# Altium schematic sheet JD-Signal-SCH-V1.2.SchDoc
size A2; SheetNumber: 1; SheetTotal: 1; SPICEModelCacheNNRSJVYG: <root> / <DocumentId>NNRSJVYG</DocumentId> / <CacheFrame Number="0"> / <Model Name="npn" Kind="MDL"> / <Text>*Default NPN BJT / *NPN Trans Pinout: C,B,E / .MODEL NPN NPN()</Text> / </Model> / <Model Name="xtal" Kind="CKT"> / <Text>*Generic type:crystal pkg:HC33/51 / .SUBCKT XTAL 1 2 PARAMS: FREQ=1Meg RS=750 C=13pf Q=1000 / LX 1 3 {((Q*RS)/(6.2831852*FREQ))} IC=0.5M / CX 3 4 {(1/(Q*6.2831852*FREQ*RS))} / C0 1 2 {C} / RS 4 2 {RS} / .ENDS XTAL</Text> / </Model> / </CacheFrame> / </root>
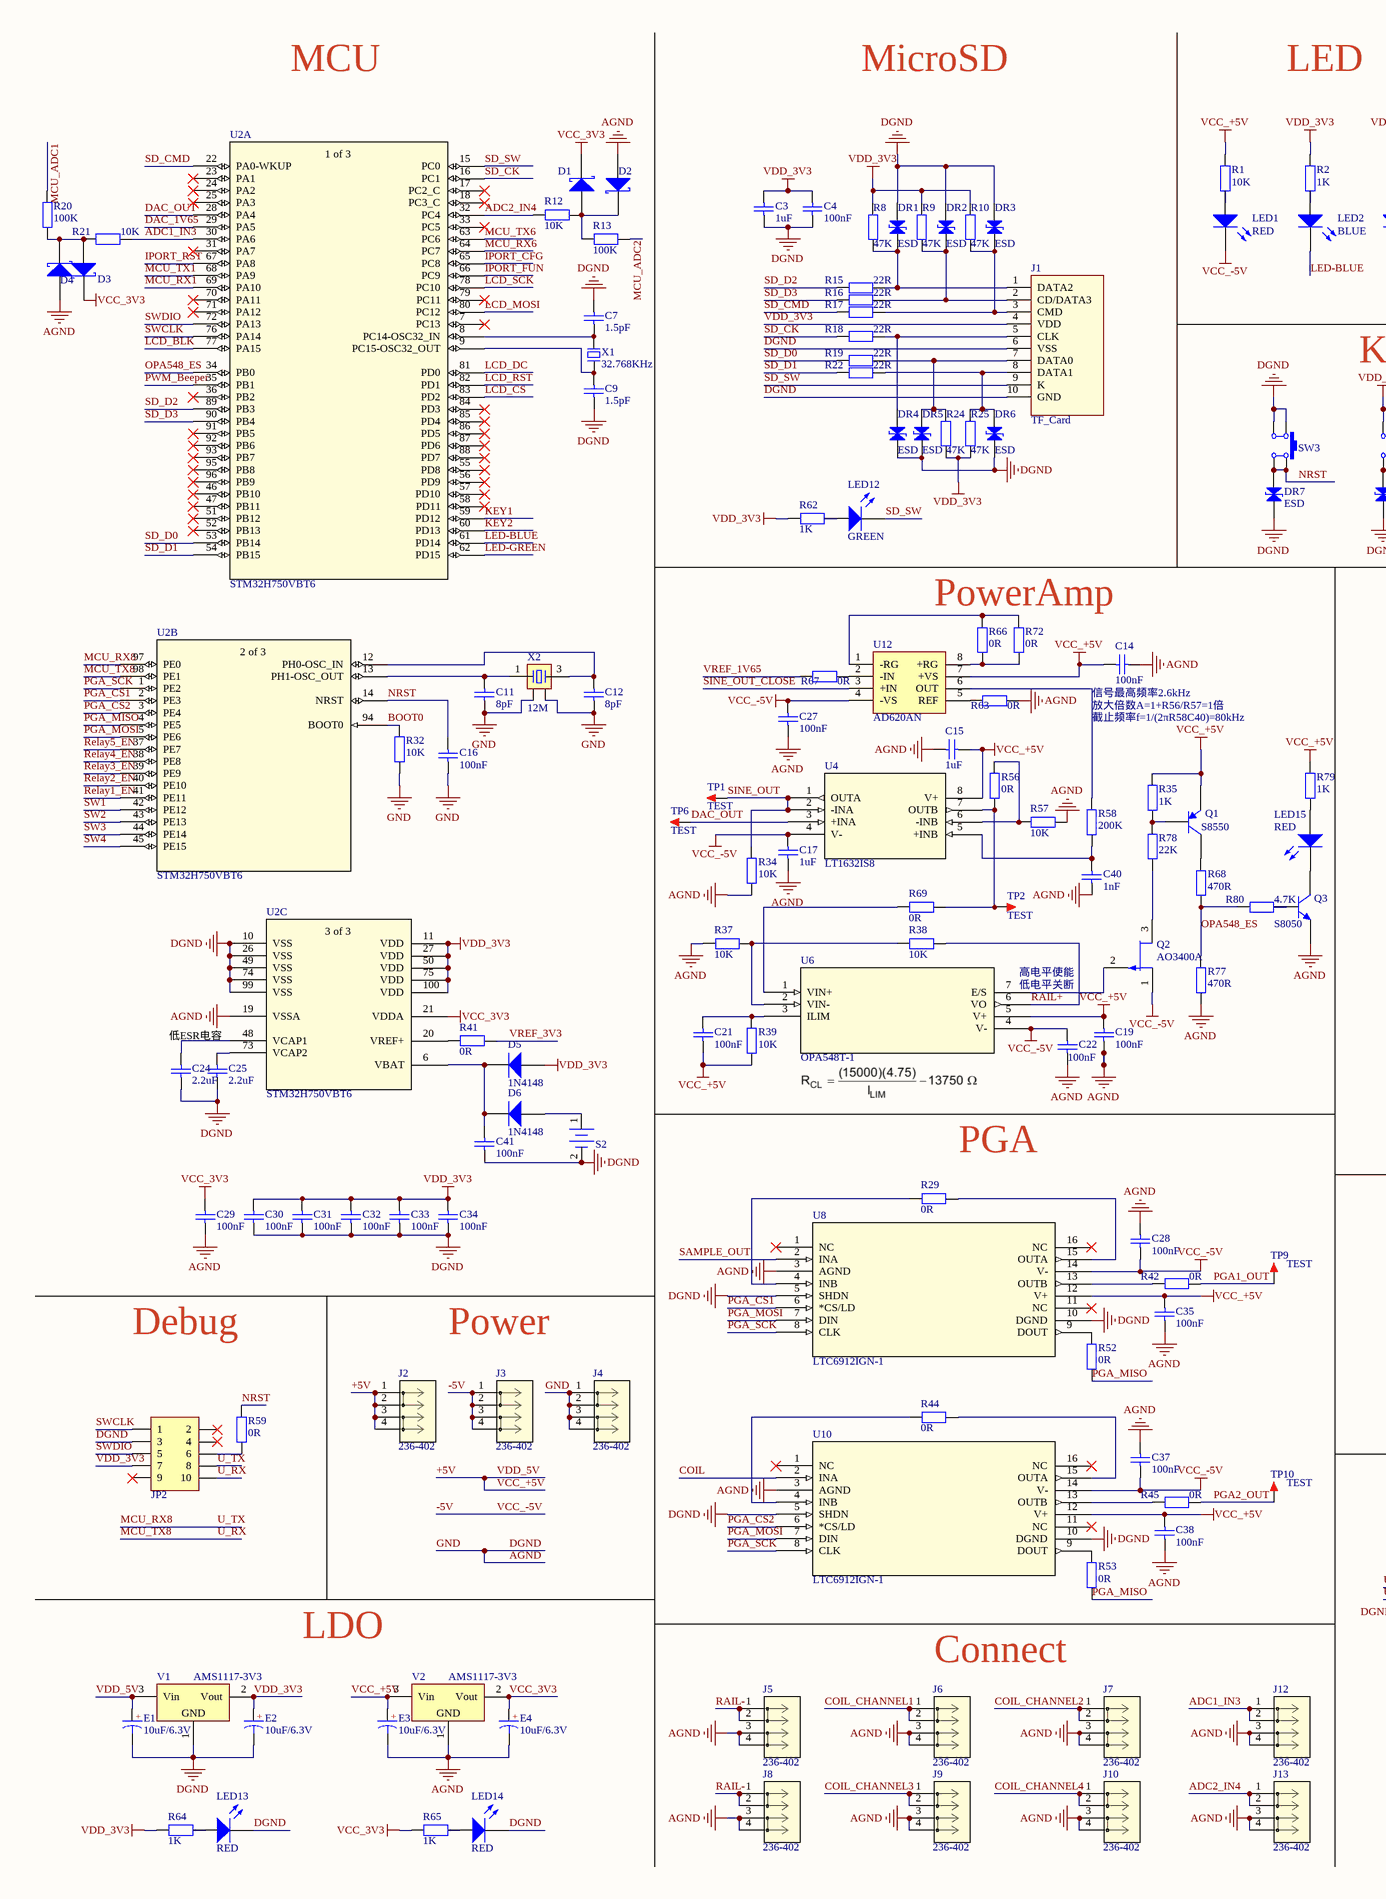
[diagram p0: JD-Signal-SCH-V1.2.SchDoc, left]
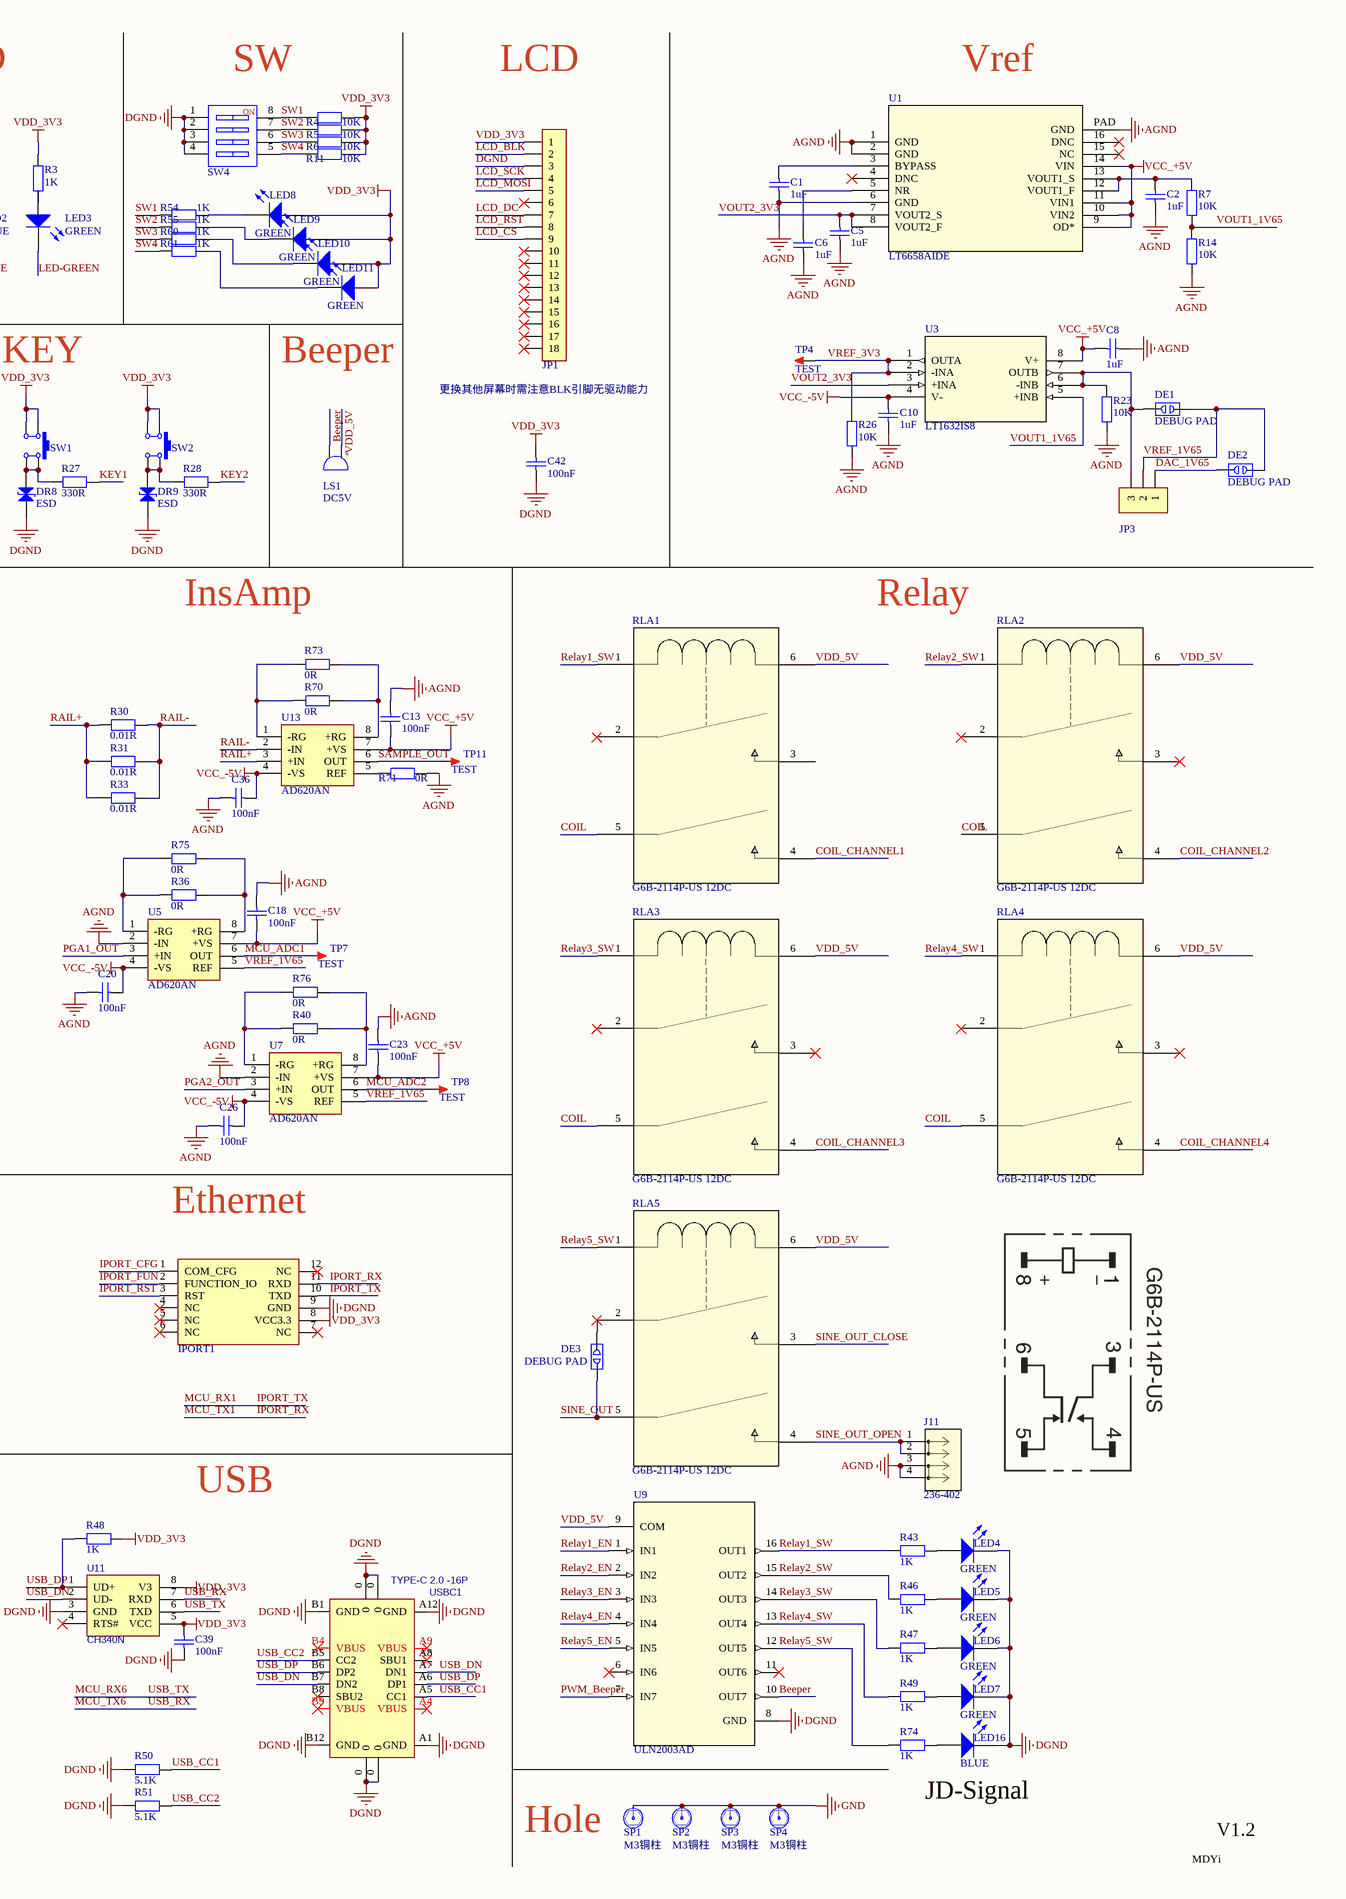
[diagram p1: JD-Signal-SCH-V1.2.SchDoc, right]

## Parts
C1  1uF  [C0603_M]
C2  1uF  [C0603_M]
C3  1uF  [C0603_M]
C4  100nF  [C0603_M]
C5  1uF  [C0603_M]
C6  1uF  [C0603_M]
C7  1.5pF  [C0603_M]
C8  1uF  [C0603_M]
C9  1.5pF  [C0603_M]
C10  1uF  [C0603_M]
C11  8pF  [C0603_M]
C12  8pF  [C0603_M]
C13  100nF  [C0603_M]
C14  100nF  [C0603_M]
C15  1uF  [C0603_M]
C16  100nF  [C0603_M]
C17  1uF  [C0603_M]
C18  100nF  [C0603_M]
C19  100nF  [C0603_M]
C20  100nF  [C0603_M]
C21  100nF  [C0603_M]
C22  100nF  [C0603_M]
C23  100nF  [C0603_M]
C24  2.2uF  [C0603_M]
C25  2.2uF  [C0603_M]
C26  100nF  [C0603_M]
C27  100nF  [C0603_M]
C28  100nF  [C0603_M]
C29  100nF  [C0603_M]
C30  100nF  [C0603_M]
C31  100nF  [C0603_M]
C32  100nF  [C0603_M]
C33  100nF  [C0603_M]
C34  100nF  [C0603_M]
C35  100nF  [C0603_M]
C36  100nF  [C0603_M]
C37  100nF  [C0603_M]
C38  100nF  [C0603_M]
C39  100nF  [C0603_M]
C40  1nF  [C0603_M]
C41  100nF  [C0603_M]
C42  100nF  [C0603_M]
D1  VS10BQ015HM3  [SMB]  (value not drawn)
D2  VS10BQ015HM3  [SMB]  (value not drawn)
D3  VS10BQ015HM3  [SMB]  (value not drawn)
D4  VS10BQ015HM3  [SMB]  (value not drawn)
D5  1N4148  [SOD-123]
D6  1N4148  [SOD-123]
DE1  DEBUG PAD  [DEBUG_B]
DE2  DEBUG PAD  [DEBUG_B]
DE3  DEBUG PAD  [DEBUG_B]
DR1  ESD  [0402]
DR2  ESD  [0402]
DR3  ESD  [0402]
DR4  ESD  [0402]
DR5  ESD  [0402]
DR6  ESD  [0402]
DR7  ESD  [0402]
DR8  ESD  [0402]
DR9  ESD  [0402]
E1  10uF/6.3V  [C_3216]
E2  10uF/6.3V  [C_3216]
E3  10uF/6.3V  [C_3216]
E4  10uF/6.3V  [C_3216]
IPORT1  IPORT-3  [IPORT]  (value not drawn)
J1  TF_Card  [Micro SD]
J2  236-402  [CONN_236-402_WAG]
J3  236-402  [CONN_236-402_WAG]
J4  236-402  [CONN_236-402_WAG]
J5  236-402  [CONN_236-402_WAG]
J6  236-402  [CONN_236-402_WAG]
J7  236-402  [CONN_236-402_WAG]
J8  236-402  [CONN_236-402_WAG]
J9  236-402  [CONN_236-402_WAG]
J10  236-402  [CONN_236-402_WAG]
J11  236-402  [CONN_236-402_WAG]
J12  236-402  [CONN_236-402_WAG]
J13  236-402  [CONN_236-402_WAG]
JP1  CON-18P  [FPC0.5-WT-18P]  (value not drawn)
JP2  Header 5X2  [HDR2.54-LI-2x5P]  (value not drawn)
JP3  HDR-1X3  [HDR2.54-LI-3P]  (value not drawn)
LED1  RED  [LED0603_R]
LED2  BLUE  [LED0603_R]
LED3  GREEN  [LED0603_R]
LED4  GREEN  [LED0603_R]
LED5  GREEN  [LED0603_R]
LED6  GREEN  [LED0603_R]
LED7  GREEN  [LED0603_R]
LED8  GREEN  [LED0603_R]
LED9  GREEN  [LED0603_R]
LED10  GREEN  [LED0603_R]
LED11  GREEN  [LED0603_R]
LED12  GREEN  [LED0603_R]
LED13  RED  [LED0603_R]
LED14  RED  [LED0603_R]
LED15  RED  [LED0603_R]
LED16  BLUE  [LED0603_R]
LS1  DC5V  [BEEP 5x9x5.5]
Q1  S8550  [SOT23]
Q2  AO3400A  [SOT23]
Q3  S8050  [SOT23]
R1  10K  [R0603_M]
R2  1K  [R0603_M]
R3  1K  [R0603_M]
R4  10K  [R0603_M]
R5  10K  [R0603_M]
R6  10K  [R0603_M]
R7  10K  [R0603_M]
R8  47K  [R0603_M]
R9  47K  [R0603_M]
R10  47K  [R0603_M]
R11  10K  [R0603_M]
R12  10K  [R0603_M]
R13  100K  [R0603_M]
R14  10K  [R0603_M]
R15  22R  [R0603_M]
R16  22R  [R0603_M]
R17  22R  [R0603_M]
R18  22R  [R0603_M]
R19  22R  [R0603_M]
R20  100K  [R0603_M]
R21  10K  [R0603_M]
R22  22R  [R0603_M]
R23  10K  [R0603_M]
R24  47K  [R0603_M]
R25  47K  [R0603_M]
R26  10K  [R0603_M]
R27  330R  [R0603_M]
R28  330R  [R0603_M]
R29  0R  [R0603_M]
R30  0.01R  [HS25]
R31  0.01R  [HS25]
R32  10K  [R0603_M]
R33  0.01R  [HS25]
R34  10K  [R0603_M]
R35  1K  [R0603_M]
R36  0R  [R0603_M]
R37  10K  [R0603_M]
R38  10K  [R0603_M]
R39  10K  [R1210_M]
R40  0R  [R0603_M]
R41  0R  [R0603_M]
R42  0R  [R0603_M]
R43  1K  [R0603_M]
R44  0R  [R0603_M]
R45  0R  [R0603_M]
R46  1K  [R0603_M]
R47  1K  [R0603_M]
R48  1K  [R0603_M]
R49  1K  [R0603_M]
R50  5.1K  [R0603_M]
R51  5.1K  [R0603_M]
R52  0R  [R0603_M]
R53  0R  [R0603_M]
R54  1K  [R0603_M]
R55  1K  [R0603_M]
R56  0R  [R0603_M]
R57  10K  [R0603_M]
R58  200K  [R0603_M]
R59  0R  [R0603_M]
R60  1K  [R0603_M]
R61  1K  [R0603_M]
R62  1K  [R0603_M]
R63  0R  [R0603_M]
R64  1K  [R0603_M]
R65  1K  [R0603_M]
R66  0R  [R0603_M]
R67  0R  [R0603_M]
R68  470R  [R0603_M]
R69  0R  [R0603_M]
R70  0R  [R0603_M]
R71  0R  [R0603_M]
R72  0R  [AXIAL0.5-1/2W]
R73  0R  [AXIAL0.5-1/2W]
R74  1K  [R0603_M]
R75  0R  [AXIAL0.5-1/2W]
R76  0R  [AXIAL0.5-1/2W]
R77  470R  [R0603_M]
R78  22K  [R0603_M]
R79  1K  [R0603_M]
R80  4.7K  [R0603_M]
RLA1  G6B-2114P-US 12DC  [RELAY_G6B-2114P_OMR]
RLA2  G6B-2114P-US 12DC  [RELAY_G6B-2114P_OMR]
RLA3  G6B-2114P-US 12DC  [RELAY_G6B-2114P_OMR]
RLA4  G6B-2114P-US 12DC  [RELAY_G6B-2114P_OMR]
RLA5  G6B-2114P-US 12DC  [RELAY_G6B-2114P_OMR]
S2  VBAT  [CR2032  BS-5]  (value not drawn)
SP1  M3铜柱  [M3x4+6_N]
SP2  M3铜柱  [M3x4+6_N]
SP3  M3铜柱  [M3x4+6_N]
SP4  M3铜柱  [M3x4+6_N]
SW1  4x4x1.5  [SW SMD-3*6*2.5]  (value not drawn)
SW2  4x4x1.5  [SW SMD-3*6*2.5]  (value not drawn)
SW3  4x4x1.5  [SW SMD-3*6*2.5]  (value not drawn)
SW4  DIP-SW-4P  [SW DIP-4P]  (value not drawn)
TP1  TEST  [TEST 1.6]
TP2  TEST  [TEST 1.6]
TP4  TEST  [TEST 1.6]
TP6  TEST  [TEST 1.6]
TP7  TEST  [TEST 1.6]
TP8  TEST  [TEST 1.6]
TP9  TEST  [TEST 1.6]
TP10  TEST  [TEST 1.6]
TP11  TEST  [TEST 1.6]
U1  LT6658AIDE  [MSOP16]
U2  STM32H750VBT6  [LQFP100-14*14]  (parts A,B,C of 3)
U3  LT1632IS8  [SO-8]
U4  LT1632IS8  [SO-8]
U5  AD620AN  [SOIC-8]
U6  OPA548T-1  [TO-220-7 - 90*45]
U7  AD620AN  [SOIC-8]
U8  LTC6912IGN-1  [SSOP-16]
U9  ULN2003AD  [SOP16]
U10  LTC6912IGN-1  [SSOP-16]
U11  CH340N  [SOIC-8]
U12  AD620AN  [SOIC-8]
U13  AD620AN  [SOIC-8]
USBC1  TYPE-C 2.0 -16P  [USB-C-SMD_16P]
V1  AMS1117-3V3  [SOT89_L]
V2  AMS1117-3V3  [SOT89_L]
X1  32.768KHz  [XTAL-3215-2P]
X2  12M  [XTAL-3225-4P]

## Nets
+5V: C8.1 C13.1 C14.2 C15.2 C18.1 C19.1 C21.1 C23.1 C35.2 C38.2 E1.1(A) E3.1(A) J2.1 J2.2 J2.3 J2.4 LS1.1 Q1.1(E) R1.2 R35.1 R39.1 R79.1 RLA1.6 RLA2.6 RLA3.6 RLA4.6 RLA5.6 U1.9(OD*) U1.10(VIN2) U1.11(VIN1) U1.14(VIN) U3.8(V+) U4.8(V+) U5.7(+VS) U6.5(V+) U7.7(+VS) U8.12(V+) U9.9(COM) U10.12(V+) U12.7(+VS) U13.7(+VS) V1.3(Vin) V2.3(Vin)  [also labelled VCC_+5V, VDD_5V]
-5V: C10.2 C17.2 C20.1 C22.2 C26.1 C27.1 C28.1 C36.1 C37.1 J3.1 J3.2 J3.3 J3.4 LED1.2(K) Q2.1(D) U3.4(V-) U4.4(V-) U5.4(-VS) U6.4(V-) U7.4(-VS) U8.14(V-) U10.14(V-) U12.4(-VS) U13.4(-VS)  [also labelled VCC_-5V]
AGND: C1.1 C2.1 C3.1 C4.1 C5.1 C6.1 C7.1 C8.2 C9.1 C10.1 C11.1 C12.1 C13.2 C14.1 C15.1 C16.1 C17.1 C18.2 C19.2 C20.2 C22.1 C23.2 C24.1 C25.1 C26.2 C27.2 C28.2 C29.1 C30.1 C31.1 C32.1 C33.1 C34.1 C35.1 C36.2 C37.2 C38.1 C39.1 C40.1 C41.1 C42.1 D2.1(A) D4.1(A) DR1.1(A) DR2.1(A) DR3.1(A) DR4.2(K) DR5.2(K) DR6.2(K) DR7.2(K) DR8.2(K) DR9.2(K) E1.2(K) E2.2(K) E3.2(K) E4.2(K) IPORT1.9(GND) J1.6(VSS) J1.10(GND) J4.1 J4.2 J4.3 J4.4 J5.3 J5.4 J6.3 J6.4 J7.3 J7.4 J8.3 J8.4 J9.3 J9.4 J10.3 J10.4 J11.3 J11.4 J12.3 J12.4 J13.3 J13.4 JP1.3 JP2.3 LED4.2(K) LED5.2(K) LED6.2(K) LED7.2(K) LED13.2(K) LED14.2(K) LED16.2(K) Q3.1(E) R14.1 R23.1 R26.1 R32.1 R34.1 R37.2 R50.2 R51.2 R57.1 R63.1 R71.1 R77.2 S2.2 SP1.1 SP2.1 SP3.1 SP4.1 SW3.1 SW3.4 SW4.1 SW4.2 SW4.3 SW4.4 U1.1(GND) U1.2(GND) U1.6(GND) U1.PAD(GND) U2.10(VSS) U2.19(VSSA) U2.26(VSS) U2.49(VSS) U2.74(VSS) U2.99(VSS) U5.2(-IN) U7.2(-IN) U8.3(AGND) U8.5(SHDN) U8.10(DGND) U9.8(GND) U10.3(AGND) U10.5(SHDN) U10.10(DGND) U11.3(GND) USBC1.0 USBC1.A1(GND) USBC1.A12(GND) USBC1.B1(GND) USBC1.B12(GND) V1.1(GND) V2.1(GND) X2.2 X2.4  [also labelled DGND, GND]
VCC_3V3: C29.2 D1.2(K) D3.2(K) E4.1(A) R65.2 U2.21(VDDA) V2.2(Vout)
VDD_3V3: C3.2 C4.2 C30.2 C31.2 C32.2 C33.2 C34.2 C39.2 C42.2 D5.1(A) E2.1(A) IPORT1.8(VCC3.3) J1.4(VDD) JP1.1 JP2.7 LED8.1(A) LED9.1(A) LED10.1(A) LED11.1(A) R2.2 R3.2 R4.1 R5.1 R6.1 R8.1 R9.1 R10.1 R11.1 R24.2 R25.2 R48.1 R62.2 R64.2 SW1.1 SW1.4 SW2.1 SW2.4 U2.11(VDD) U2.27(VDD) U2.50(VDD) U2.75(VDD) U2.100(VDD) U11.5(VCC) U11.8(V3) V1.2(Vout)
ADC1_IN3: J12.1 J12.2 R21.1 U2.30(PA6)
ADC2_IN4: J13.1 J13.2 R12.2 U2.32(PC4)
Beeper: LS1.2 U9.10(OUT7)
BOOT0: R32.2 U2.94(BOOT0)
COIL: RLA1.5 RLA2.5 RLA3.5 RLA4.5 U10.2(INA)
COIL_CHANNEL1: J6.1 J6.2 RLA1.4
COIL_CHANNEL2: J7.1 J7.2 RLA2.4
COIL_CHANNEL3: J9.1 J9.2 RLA3.4
COIL_CHANNEL4: J10.1 J10.2 RLA4.4
DAC_1V65: DE2.1 JP3.1 U2.29(PA5)
DAC_OUT: TP6.1 U2.28(PA4) U4.3(+INA)
IPORT_CFG: IPORT1.1(COM_CFG) U2.65(PC8)
IPORT_FUN: IPORT1.2(FUNCTION_IO) U2.66(PC9)
IPORT_RST: IPORT1.3(RST) U2.67(PA8)
IPORT_RX: IPORT1.11(RXD) U2.68(PA9)  [also labelled MCU_TX1]
IPORT_TX: IPORT1.10(TXD) U2.69(PA10)  [also labelled MCU_RX1]
KEY1: R27.1 U2.59(PD12)
KEY2: R28.1 U2.60(PD13)
LCD_BLK: JP1.2 U2.77(PA15)
LCD_CS: JP1.9 U2.83(PD2)
LCD_DC: JP1.7 U2.81(PD0)
LCD_MOSI: JP1.5 U2.80(PC12)
LCD_RST: JP1.8 U2.82(PD1)
LCD_SCK: JP1.4 U2.78(PC10)
LED-BLUE: LED2.2(K) U2.61(PD14)
LED-GREEN: LED3.2(K) U2.62(PD15)
MCU_ADC1: R20.2 TP7.1 U5.6(OUT)
MCU_ADC2: R13.1 TP8.1 U7.6(OUT)
MCU_RX6: U2.64(PC7) U11.6(TXD)  [also labelled USB_TX]
MCU_RX8: JP2.8 U2.97(PE0)  [also labelled U_TX]
MCU_TX6: U2.63(PC6) U11.7(RXD)  [also labelled USB_RX]
MCU_TX8: JP2.10 U2.98(PE1)  [also labelled U_RX]
NRST: C16.2 DR7.1(A) R59.1 SW3.2 SW3.3 U2.14(NRST)
OPA548_ES: R68.2 R77.1 R80.2 U2.34(PB0)
PGA1_OUT: R42.2 TP9.1 U5.3(+IN)
PGA2_OUT: R45.2 TP10.1 U7.3(+IN)
PGA_CS1: U2.2(PE3) U8.6(*CS/LD)
PGA_CS2: U2.3(PE4) U10.6(*CS/LD)
PGA_MISO: R52.1 R53.1 U2.4(PE5)
PGA_MOSI: U2.5(PE6) U8.7(DIN) U10.7(DIN)
PGA_SCK: U2.1(PE2) U8.8(CLK) U10.8(CLK)
PWM_Beeper: U2.35(PB1) U9.7(IN7)
RAIL+: R30.1 R31.1 R33.1 R38.1 U6.6(VO) U13.3(+IN)
RAIL-: J5.1 J5.2 J8.1 J8.2 R30.2 R31.2 R33.2 U13.2(-IN)
Relay1_EN: U2.41(PE11) U9.1(IN1)
Relay1_SW: R43.1 RLA1.1 U9.16(OUT1)
Relay2_EN: U2.40(PE10) U9.2(IN2)
Relay2_SW: R46.1 RLA2.1 U9.15(OUT2)
Relay3_EN: U2.39(PE9) U9.3(IN3)
Relay3_SW: R47.1 RLA3.1 U9.14(OUT3)
Relay4_EN: U2.38(PE8) U9.4(IN4)
Relay4_SW: R49.1 RLA4.1 U9.13(OUT4)
Relay5_EN: U2.37(PE7) U9.5(IN5)
Relay5_SW: R74.1 RLA5.1 U9.12(OUT5)
SAMPLE_OUT: TP11.1 U8.2(INA) U13.6(OUT)
SD_CK: R18.2 U2.16(PC1)
SD_CMD: R17.2 U2.22(PA0-WKUP)
SD_D0: R19.2 U2.53(PB14)
SD_D1: R22.2 U2.54(PB15)
SD_D2: R15.2 U2.89(PB3)
SD_D3: R16.2 U2.90(PB4)
SD_SW: J1.9(K) LED12.2(K) U2.15(PC0)
SINE_OUT: DE3.1 R34.2 RLA5.5 TP1.1 U4.1(OUTA) U4.2(-INA)
SINE_OUT_CLOSE: RLA5.3 U12.3(+IN)
SINE_OUT_OPEN: J11.1 J11.2 RLA5.4
SW1: R4.2 R54.2 SW4.8 U2.42(PE12)
SW2: R5.2 R55.2 SW4.7 U2.43(PE13)
SW3: R6.2 R60.2 SW4.6 U2.44(PE14)
SW4: R11.2 R61.2 SW4.5 U2.45(PE15)
SWCLK: JP2.1 U2.76(PA14)
SWDIO: JP2.5 U2.72(PA13)
USB_CC1: R50.1 USBC1.A5(CC1)
USB_CC2: R51.1 USBC1.B5(CC2)
USB_DN: U11.2(UD-) USBC1.A7(DN1) USBC1.B7(DN2)
USB_DP: R48.2 U11.1(UD+) USBC1.A6(DP1) USBC1.B6(DP2)
VOUT1_1V65: R7.1 R14.2 U3.5(+INB)
VOUT2_3V3: C5.2 U1.7(VOUT2_S) U1.8(VOUT2_F) U3.3(+INA)
VREF_1V65: DE1.2 DE2.2 JP3.2 R67.2 U5.5(REF) U7.5(REF)
VREF_3V3: R26.2 R41.1 TP4.1 U3.1(OUTA) U3.2(-INA)
NetC1_2: C1.2 U1.3(BYPASS)
NetC2_2: C2.2 R7.2 U1.12(VOUT1_F) U1.13(VOUT1_S)
NetC6_2: C6.2 U1.5(NR)
NetC7_2: C7.2 U2.8(PC14-OSC32_IN) X1.2
NetC9_2: C9.2 U2.9(PC15-OSC32_OUT) X1.1
NetC11_2: C11.2 U2.13(PH1-OSC_OUT) X2.1
NetC12_2: C12.2 U2.12(PH0-OSC_IN) X2.3
NetC21_2: C21.2 R39.2 U6.3(ILIM)
NetC24_2: C24.2 U2.48(VCAP1)
NetC25_2: C25.2 U2.73(VCAP2)
NetC40_2: C40.2 R58.2 U4.5(+INB)
NetC41_2: C41.2 D5.2(K) D6.2(K) U2.6(VBAT)
NetD1_1: D1.1(A) D2.2(K) R12.1 R13.2
NetD3_1: D3.1(A) D4.2(K) R20.1 R21.2
NetD6_1: D6.1(A) S2.1
NetDE1_1: DE1.1 JP3.3 R23.2 U3.6(-INB) U3.7(OUTB)
NetDE3_2: DE3.2 RLA5.2
NetDR1_2: DR1.2(K) J1.1(DATA2) R8.2 R15.1
NetDR2_2: DR2.2(K) J1.2(CD/DATA3) R9.2 R16.1
NetDR3_2: DR3.2(K) J1.3(CMD) R10.2 R17.1
NetDR4_1: DR4.1(A) J1.5(CLK) R18.1
NetDR5_1: DR5.1(A) J1.7(DATA0) R19.1 R24.1
NetDR6_1: DR6.1(A) J1.8(DATA1) R22.1 R25.1
NetDR8_1: DR8.1(A) R27.2 SW1.2 SW1.3
NetDR9_1: DR9.1(A) R28.2 SW2.2 SW2.3
NetJP2_6: JP2.6 R59.2
NetLED1_1: LED1.1(A) R1.1
NetLED2_1: LED2.1(A) R2.1
NetLED3_1: LED3.1(A) R3.1
NetLED4_1: LED4.1(A) R43.2
NetLED5_1: LED5.1(A) R46.2
NetLED6_1: LED6.1(A) R47.2
NetLED7_1: LED7.1(A) R49.2
NetLED8_2: LED8.2(K) R54.1
NetLED9_2: LED9.2(K) R55.1
NetLED10_2: LED10.2(K) R60.1
NetLED11_2: LED11.2(K) R61.1
NetLED12_1: LED12.1(A) R62.1
NetLED13_1: LED13.1(A) R64.1
NetLED14_1: LED14.1(A) R65.1
NetLED15_1: LED15.1(A) R79.2
NetLED15_2: LED15.2(K) Q3.3(C)
NetLED16_1: LED16.1(A) R74.2
NetQ1_2: Q1.2(B) R35.2 R78.1
NetQ1_3: Q1.3(C) R68.1
NetQ2_2: Q2.2(G) U6.7(E/S)
NetQ2_3: Q2.3(S) R78.2
NetQ3_2: Q3.2(B) R80.1
NetR29_1: R29.1 U8.15(OUTA)
NetR29_2: R29.2 U8.4(INB)
NetR36_1: R36.1 R75.1 U5.8(+RG)
NetR36_2: R36.2 R75.2 U5.1(-RG)
NetR37_1: R37.1 R38.2 U6.2(VIN-)
NetR40_1: R40.1 R76.1 U7.8(+RG)
NetR40_2: R40.2 R76.2 U7.1(-RG)
NetR41_2: R41.2 U2.20(VREF+)
NetR42_1: R42.1 U8.13(OUTB)
NetR44_1: R44.1 U10.15(OUTA)
NetR44_2: R44.2 U10.4(INB)
NetR45_1: R45.1 U10.13(OUTB)
NetR52_2: R52.2 U8.9(DOUT)
NetR53_2: R53.2 U10.9(DOUT)
NetR56_1: R56.1 R57.2 U4.6(-INB)
NetR56_2: R56.2 R69.2 TP2.1 U4.7(OUTB)
NetR58_1: R58.1 U12.6(OUT)
NetR63_2: R63.2 U12.5(REF)
NetR66_1: R66.1 R72.1 U12.1(-RG)
NetR66_2: R66.2 R72.2 U12.8(+RG)
NetR67_1: R67.1 U12.2(-IN)
NetR69_1: R69.1 U6.1(VIN+)
NetR70_1: R70.1 R73.1 U13.8(+RG)
NetR70_2: R70.2 R73.2 U13.1(-RG)
NetR71_2: R71.2 U13.5(REF)

Not connected (* = marked no-connect by the designer): IPORT1 4(NC)* 5(NC)* 6(NC)* 7(NC)* 12(NC)*; JP1 6* 10* 11* 12* 13* 14* 15* 16* 17* 18*; JP2 2* 4* 9*; RLA1 2(3)* 3(4); RLA2 2(3)* 3(4)*; RLA3 2(3)* 3(4)*; RLA4 2(3)* 3(4)*; U1 4(DNC)* 15(NC)* 16(DNC)*; U2 7(PC13)* 17(PC2_C)* 18(PC3_C)* 23(PA1)* 24(PA2)* 25(PA3)* 31(PA7)* 33(PC5)* 36(PB2)* 46(PB10)* 47(PB11)* 51(PB12)* 52(PB13)* 55(PD8)* 56(PD9)* 57(PD10)* 58(PD11)* 70(PA11)* 71(PA12)* 79(PC11)* 84(PD3)* 85(PD4)* 86(PD5)* 87(PD6)* 88(PD7)* 91(PB5)* 92(PB6)* 93(PB7)* 95(PB8)* 96(PB9)*; U8 1(NC)* 11(NC)* 16(NC)*; U9 6(IN6)* 11(OUT6)*; U10 1(NC)* 11(NC)* 16(NC)*; U11 4(RTS#)*; USBC1 A4(VBUS)* A8(SBU1)* A9(VBUS)* B4(VBUS)* B8(SBU2)* B9(VBUS)*

## Notes on the sheet
- MCU
- MicroSD
- LED
- (near SW4) SW
- LCD
- Vref
- KEY
- Beeper
- (near JP1) 更换其他屏幕时需注意BLK引脚无驱动能力
- PowerAmp
- InsAmp
- Relay
- (near C14) 信号最高频率2.6kHz
- (near C14) 放大倍数A=1+R56/R57=1倍
- 截止频率f=1/(2πR58C40)=80kHz
- (near U6) 高电平使能
- (near U6) 低电平关断
- 低ESR电容
- (near R29) PGA
- Ethernet
- Debug
- Power
- USB
- LDO
- Connect
- JD-Signal
- (near SP1) Hole
- MDYi
- V1.2
- (in symbol BEEP) +
- (in symbol CT) +
- (in symbol DIP-SW-4P) NO
- (in symbol STM32H750VBT6, part A) 1 of 3
- (in symbol STM32H750VBT6, part B) 2 of 3
- (in symbol STM32H750VBT6, part C) 3 of 3

## Library data of the parts
C1-C42 = C: 贴片电容/MLCC电容; BOM名称: 无极性贴片电容; 联系下单店铺卖家 免费帮你查找封装: 联系下单店铺卖家 免费技术支持
D1-D4 = D-Schottky: 肖特基二极管; 当前库版本V2022.10.7 @淘宝卖家:黄晶宝石: 最新版本发布https://shop463601444.taobao.com
D5 D6 = Diode 1N4148: High Conductance Fast Diode; Published: 8-Jun-2000; LatestRevisionDate: 17-Jul-2002; LatestRevisionNote: Re-released for DXP Platform.; DatasheetVersion: 1997; PackageReference: DO-35; Publisher: Altium Limited; PackageDescription: Diode, Axial; Body 3.8 x 1.9 mm (LxDia. max), Lead Dia. 0.53 mm (max); Code_JEDEC: DO-204-AH; ComponentLink1Description: Manufacturer Link; ComponentLink1URL: http://www.fairchildsemi.com/; ComponentLink2Description: Datasheet; ComponentLink2URL: http://www.fairchildsemi.com/ds/1N%2F1N4148.pdf
DE1-DE3 = DEBUG: 调试断点焊盘; 联系下单店铺卖家 免费技术支持: 联系下单店铺卖家 免费帮你查找封装; BOM名称: 调试断点焊盘
DR1-DR9 = DR: 瞬态电压抑制二极管; 当前库版本V2022.10.7 @淘宝卖家:黄晶宝石: 最新版本发布https://shop463601444.taobao.com; BOM名称: 瞬态电压抑制二极管
E1-E4 = CT: 贴片钽电容; 联系下单店铺卖家 免费帮你查找封装: 联系下单店铺卖家 免费技术支持; BOM名称: 贴片钽电容
IPORT1 = IPORT-3: BOM名称: 12P连接器; 封装库来自淘宝卖家 ID：黄晶宝石: 其他店铺购入均为盗版假冒封装库; 联系卖家 免费查找封装: 唯一出售店铺网址https://shop463601444.taobao.com
J1 = TF_Card: TF卡座; 当前库版本V2022.10.7 @淘宝卖家:黄晶宝石: 最新版本发布https://shop463601444.taobao.com; BOM名称: TF卡座
J2-J13 = 236-402: No Description Available; Mfr_Name: Wago; Copyright: Copyright (C) 2022 Ultra Librarian. All rights reserved.; Manufacturer_Part_Number: 236-402; RefDes: RefDes; Type: DEV
JP1 = Header 18: 18P连接器; 封装库来自淘宝卖家：黄晶宝石: 获取最新版本https://shop463601444.taobao.com; BOM名称: 18P连接器
JP2 = Header 5X2: 5*2P接插件; 联系卖家，免费查找封装: 唯一出售店铺网址https://shop463601444.taobao.com; 封装库来自淘宝卖家ID：黄晶宝石: 其他店铺购入均为盗版封装库，请立即申请退款，本店现金奖励50~200元; BOM名称: 5*2P接插件
JP3 = Header 3: 3P接插件; 联系卖家，免费查找封装: 唯一出售店铺网址https://shop463601444.taobao.com; 封装库来自淘宝卖家ID：黄晶宝石: 其他店铺购入均为盗版封装库，请立即申请退款，本店现金奖励50~200元; BOM名称: 3P接插件
LED1-LED16 = LED: 贴片LED; 封装库来自淘宝卖家：黄晶宝石: 其他店铺购入均为盗版封装库，无更新权益，退款现金奖励200~1000元; BOM名称: 贴片LED
LS1 = BEEP: 蜂鸣器; 联系下单店铺卖家 免费技术支持: 联系下单店铺卖家 免费帮你查找封装; BOM名称: 蜂鸣器
Q1 = 2N3906: PNP General Purpose Amplifier; Published: 8-Jun-2000; LatestRevisionDate: 15-Jan-2003; LatestRevisionNote: PCB Footprint 'BCY-W3/D4.7' replaced; DatasheetVersion: 1997; PackageVersion: Sep-1998; PackageReference: TO-92A; Publisher: Altium Limited; PackageDescription: TO, Flat Index; 3 In-Line, Axial Leads; Body Dia. 4.5mm; Leads 0.51 x 0.48 mm (max); ComponentLink1Description: Manufacturer Link; ComponentLink1URL: http://www.fairchildsemi.com/; ComponentLink2Description: Datasheet; ComponentLink2URL: http://www.fairchildsemi.com/ds/2N%2F2N3906.pdf
Q2 = JFET-P: P-Channel JFET; Published: 8-Jun-2000; LatestRevisionDate: 17-Jul-2002; LatestRevisionNote: Re-released for DXP Platform.; PackageReference: TO-18A; Publisher: Altium Limited; PackageDescription: SC-89; 3 Flat Leads; Body 1.6 x 1.6 x 0.7 mm, inc leads (LxWxH typ)
Q3 = 2N3904: NPN General Purpose Amplifier; Published: 8-Jun-2000; LatestRevisionDate: 15-Jan-2003; LatestRevisionNote: PCB Footprint 'BCY-W3/D4.7' replaced; DatasheetVersion: 1997; PackageVersion: Sep-1998; PackageReference: TO-92A; Publisher: Altium Limited; PackageDescription: TO, Flat Index; 3 In-Line, Axial Leads; Body Dia. 4.5mm; Leads 0.51 x 0.48 mm (max); ComponentLink1Description: Manufacturer Link; ComponentLink1URL: http://www.fairchildsemi.com/; ComponentLink2Description: Datasheet; ComponentLink2URL: http://www.fairchildsemi.com/ds/2N%2F2N3904.pdf
R1-R80 = R: 贴片电阻; 当前库版本V2022.10.7 @黄晶宝石: 最新版本发布https://shop463601444.taobao.com; BOM名称: 贴片电阻
RLA1-RLA5 = G6B-2114P-US 12DC: No Description Available; Mfr_Name: Omron; Copyright: Copyright (C) 2022 Ultra Librarian. All rights reserved.; Manufacturer_Part_Number: G6B-2114P-US 12DC; RefDes: RefDes; Type: DEV
S2 = VBAT: 纽扣电池
SP1-SP4 = 铜柱加头大焊盘: 铜柱; 联系下单店铺卖家 免费技术支持: 联系下单店铺卖家 免费帮你查找封装; BOM名称: 铜柱
SW1-SW3 = SW SMD-4x4: 贴片4x4轻触开关; 联系下单店铺卖家 免费技术支持: 联系下单店铺卖家 免费帮你查找封装; BOM名称: 贴片4x4轻触开关
SW4 = DIP-SW-4P: 4路编码开关; 联系下单店铺卖家 免费技术支持: 联系下单店铺卖家 免费帮你查找封装; BOM名称: 4路编码开关
TP1 TP2 TP4 TP6-TP11 = TEST: 测试点; 联系下单店铺卖家 免费技术支持: 联系下单店铺卖家 免费帮你查找封装; BOM名称: 测试点
U1 = LT6658AIDE: No Description Available; Copyright: Copyright (C) 2021 Accelerated Designs. All rights reserved; RefDes: RefDes; Type: DEV
U2 = STM32H750VBT6: No Description Available; Mfr_Name: STMicroelectronics; Copyright: Copyright (C) 2022 Ultra Librarian. All rights reserved.; Manufacturer_Part_Number: STM32H750VBT6; RefDes: RefDes; Type: DEV
U3 U4 = LT1632IS8: No Description Available; Vendor: Linear Technology; Manufacturer_Part_Number: lt1632is8; Copyright: Copyright (C) 2021 Accelerated Designs. All rights reserved; RefDes: RefDes; Type: DEV
U5 U7 U12 U13 = AD620AN: CI-AD620AN; 封装库来自淘宝卖家：黄晶宝石: 获取最新版本库文件https://shop463601444.taobao.com
U6 = OPA548T-1: No Description Available; Mfr_Name: Texas Instruments; Copyright: Copyright (C) 2022 Ultra Librarian. All rights reserved.; Manufacturer_Part_Number: OPA548T-1; RefDes: RefDes; Type: DEV
U8 U10 = LTC6912IGN-1: No Description Available; Vendor: Linear Technology; Manufacturer_Part_Number: ltc6912ign-1; Copyright: Copyright (C) 2021 Accelerated Designs. All rights reserved; RefDes: RefDes; Type: DEV
U9 = ULN2003AD: No Description Available; Mfr_Name: Texas Instruments; Type: DEV; RefDes: RefDes; Copyright: Copyright (C) 2022 Ultra Librarian. All rights reserved.; Manufacturer_Part_Number: ULN2003AD
U11 = CH340N: USB转串口芯片, 内置晶振; 芯片厂商: WCH(南京沁恒); 当前库版本V2022.10.7 @淘宝卖家:黄晶宝石: 最新版本发布https://shop463601444.taobao.com
USBC1 = USB2.0_Type-C_16Pin: USB2.0_Type-C_16Pin母座; 当前库版本V2022.10.7 @淘宝卖家:黄晶宝石: 最新版本发布https://shop463601444.taobao.com
V1 V2 = AMS1117_SOT89: 三端稳压芯片; BOM名称: 稳压芯片; 当前库版本V2022.10.7 @淘宝卖家:黄晶宝石: 最新版本发布https://shop463601444.taobao.com
X1 = XTAL-2P: 2脚无源晶振(谐振器）; 当前库版本V2022.10.7 @黄晶宝石: 最新版本发布https://shop463601444.taobao.com; BOM名称: 2脚无源晶振(谐振器）
X2 = XTAL-4P: 4脚无源晶振(谐振器）; 当前库版本V2022.10.7 @黄晶宝石: 最新版本发布https://shop463601444.taobao.com; BOM名称: 4脚无源晶振(谐振器）